# EasyEDA schematic 1-Schematic_New Project2.json
TITLE: Sheet_1; REV: 1.0; Date: 2024-07-23; Sheet: 1/1; Drawn By: shaheeransari57; Company: Your Company
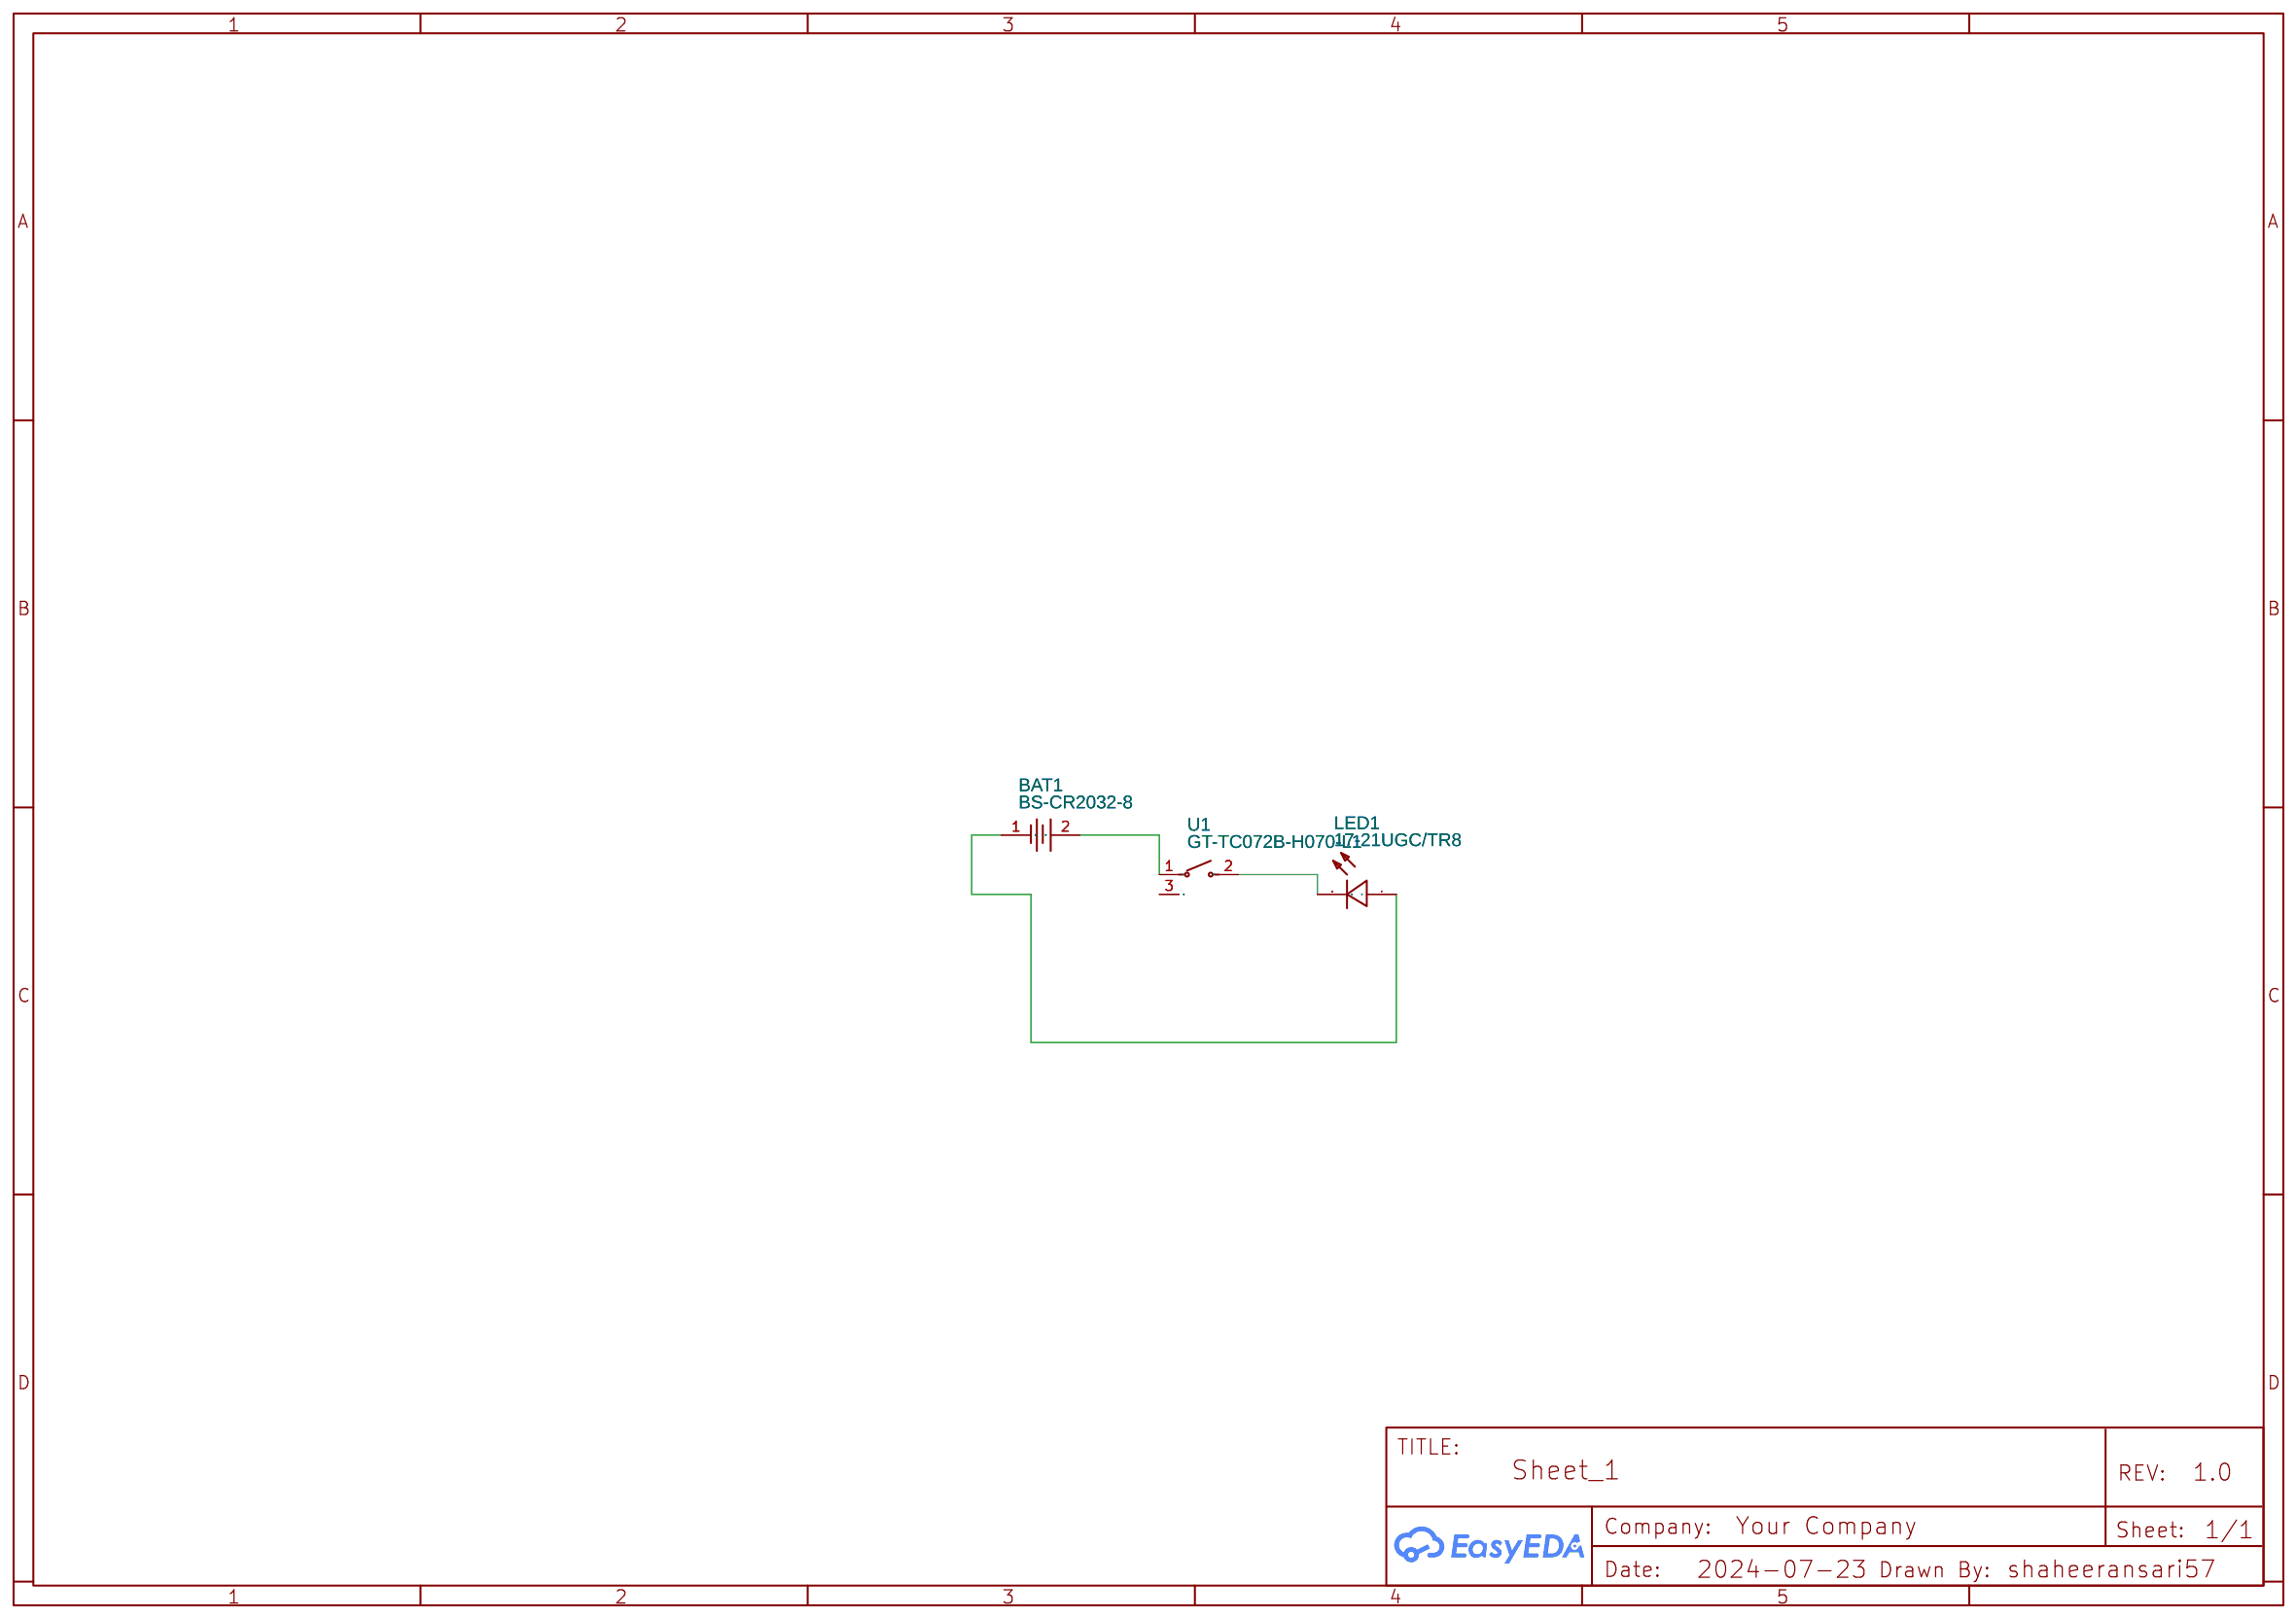
[diagram p0: schematic sheet]

## Parts
BAT1  BS-CR2032-8  [BAT-SMD_BS-CR2032-8]
LED1  17-21UGC/TR8  [LED0805-R-RD_GREEN]
U1  GT-TC072B-H070-L1  [SW-SMD_G-SWITCH_GT-TC072B-H070-L1]

## Library data of the parts
BAT1 = BS-CR2032-8: Supplier: LCSC; Supplier Part: C7498149; Manufacturer: LX(连欣科技); Contributor: lcsc; JLCPCB Part Class: Extended Part
LED1 = 17-21UGC/TR8: Contributor: LCSC; Supplier: LCSC; Supplier Part: C264418; Manufacturer: EVERLIGHT(亿光); JLCPCB Part Class: Extended Part
U1 = GT-TC072B-H070-L1: Contributor: lcsc; Supplier: LCSC; Supplier Part: C5117869; Manufacturer: G-Switch(品赞); JLCPCB Part Class: Extended Part

## Nets
Net-(BAT1-1): BAT1.1 LED1.1(A)
Net-(BAT1-2): BAT1.2 U1.1
Net-(LED1-2): LED1.2(K) U1.2

Not connected (* = marked no-connect by the designer): U1 3
